# EAGLE schematic PCB (EAGLE 7.2.0)
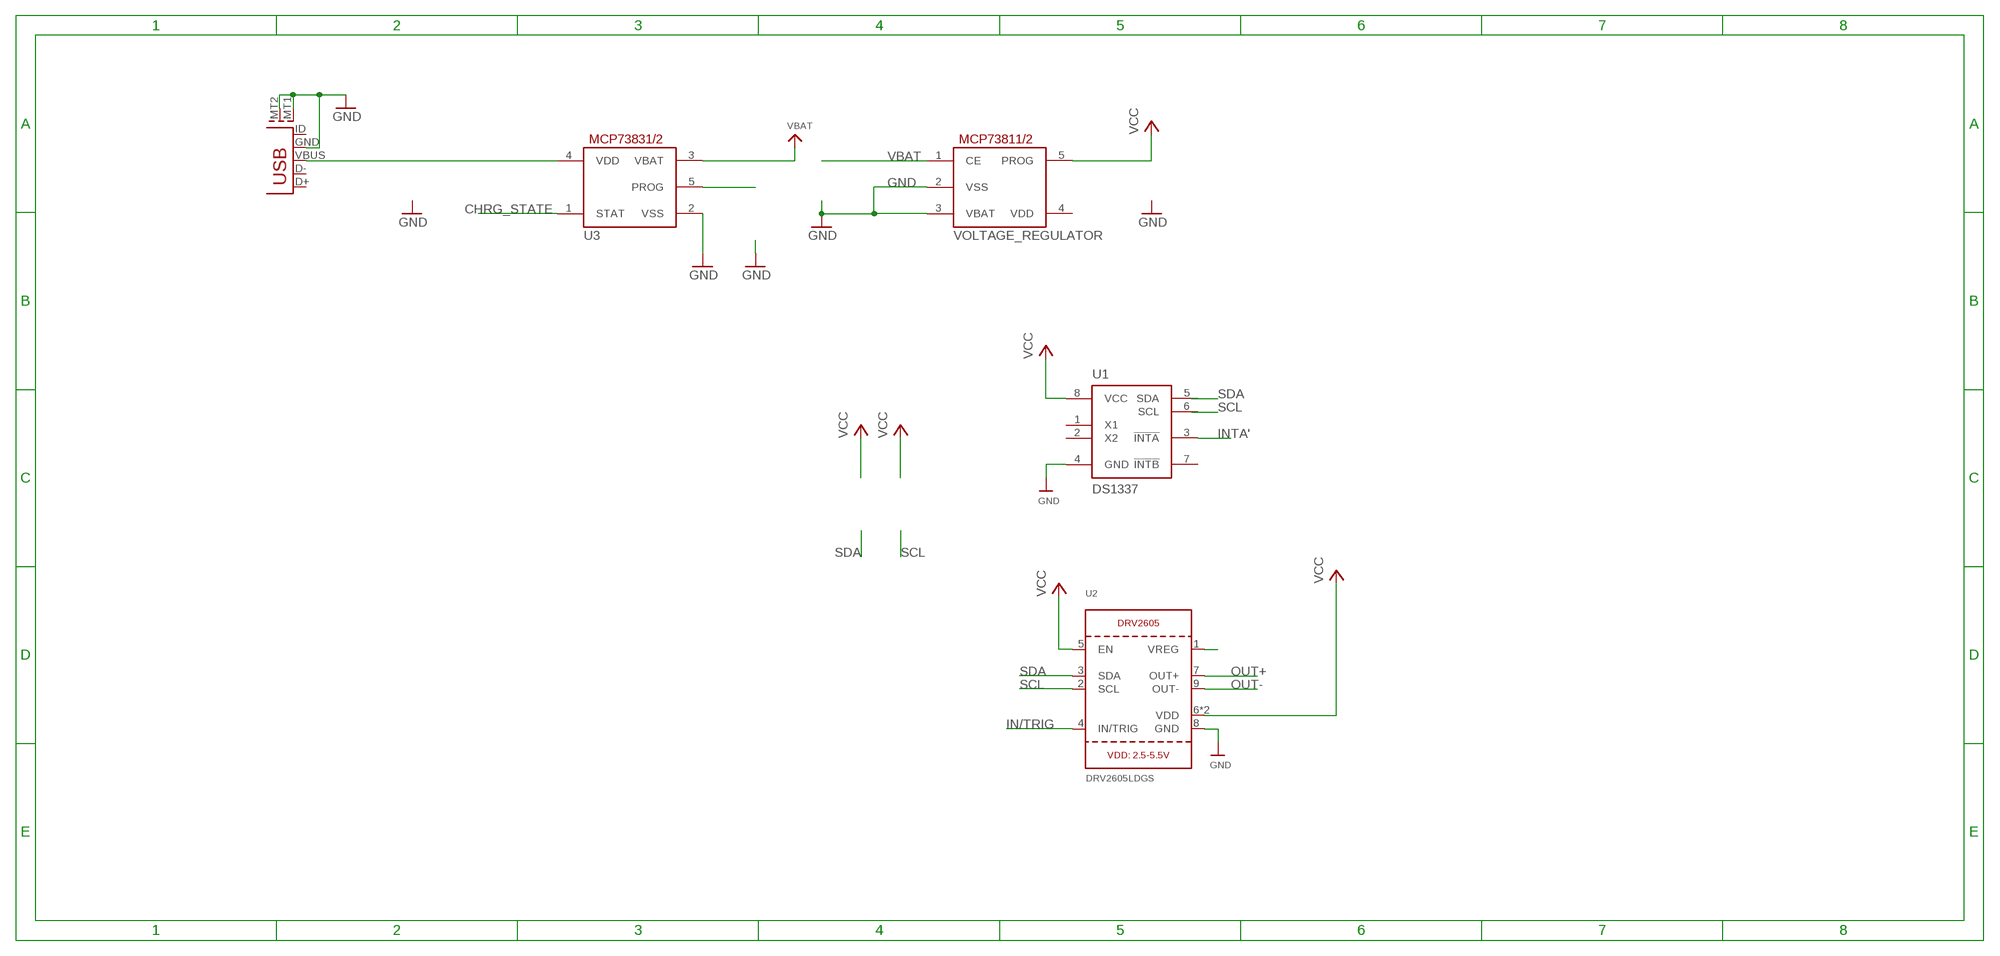
[diagram p0: schematic, sheet 1]

## Parts
U1  DS1337  [UMAX8]
U2  DRV2605LDGS  DRV2605_SOP  [PSOP10]
U3  MCP73832T-2ACI/OT  MCP73831/OT  [SOT23-5L]
USB1  USB-MICROBLARGEPAD  [USB-MICROB_LARGEPAD]
VOLTAGE_REGULATOR  MCP73811/2  [SOT23-5L]

## Nets
CHRG_STATE: U3.1(STAT)
GND: U1.4(GND) U2.8(GND) U3.2(VSS) USB1.GND USB1.MT1(SHEILD1) USB1.MT2(SHEILD2) VOLTAGE_REGULATOR.2(VSS) VOLTAGE_REGULATOR.3(VBAT)
IN/TRIG: U2.4(IN/TRIG)
INTA': U1.3(!INTA)
N$5: U2.1(VREG)
N$6: U3.4(VDD) USB1.VBUS
N$10: U3.5(PROG)
OUT+: U2.7(OUT+)
OUT-: U2.9(OUT-)
SCL: U2.2(SCL)
SDA: U2.3(SDA)
VBAT: U3.3(VBAT) VOLTAGE_REGULATOR.1(CE)
VCC: U1.8(VCC) U2.5(EN) U2.6(VDD) U2.10(VDD) VOLTAGE_REGULATOR.5(PROG)
Unconnected: U1.1(X1) U1.2(X2) U1.5(SDA) U1.6(SCL) U1.7(!INTB) USB1.D+ USB1.D- USB1.ID

## Power pins joined to a net without a drawn wire
VDD: VOLTAGE_REGULATOR.4(VDD)

## Library data of the parts
U1 = ds1337:DS1337: Real-time clock IC
U2 = microbuilder:DRV2605: DRV2605 - Haptic Driver for ERM/LRA Motors
U3 = adafruit:MCP73831: MCP73831/2 Miniature Single-Cell, Fully Integrated Li-Ion, Li-Polymer Charge Management Controllers. Nice and small simple lipoly charge controller, with adjustable current and status output (LED) http://www.ladyada.net/library/pcb/eaglelibrary.html
USB1 = zak:USB-MICROB
VOLTAGE_REGULATOR = adafruit:MCP73811/2: MCP73811 and MCP73812 Simple, Miniature Single-Cell, Fully Integrated Li-Ion / Li-Polymer Charge Management Controllers SOT-23-5 package, no indicator LED but with adjustable current, small and very inexpensive